# EAGLE design edition4-mainpart-3 (EAGLE 9.6.2)
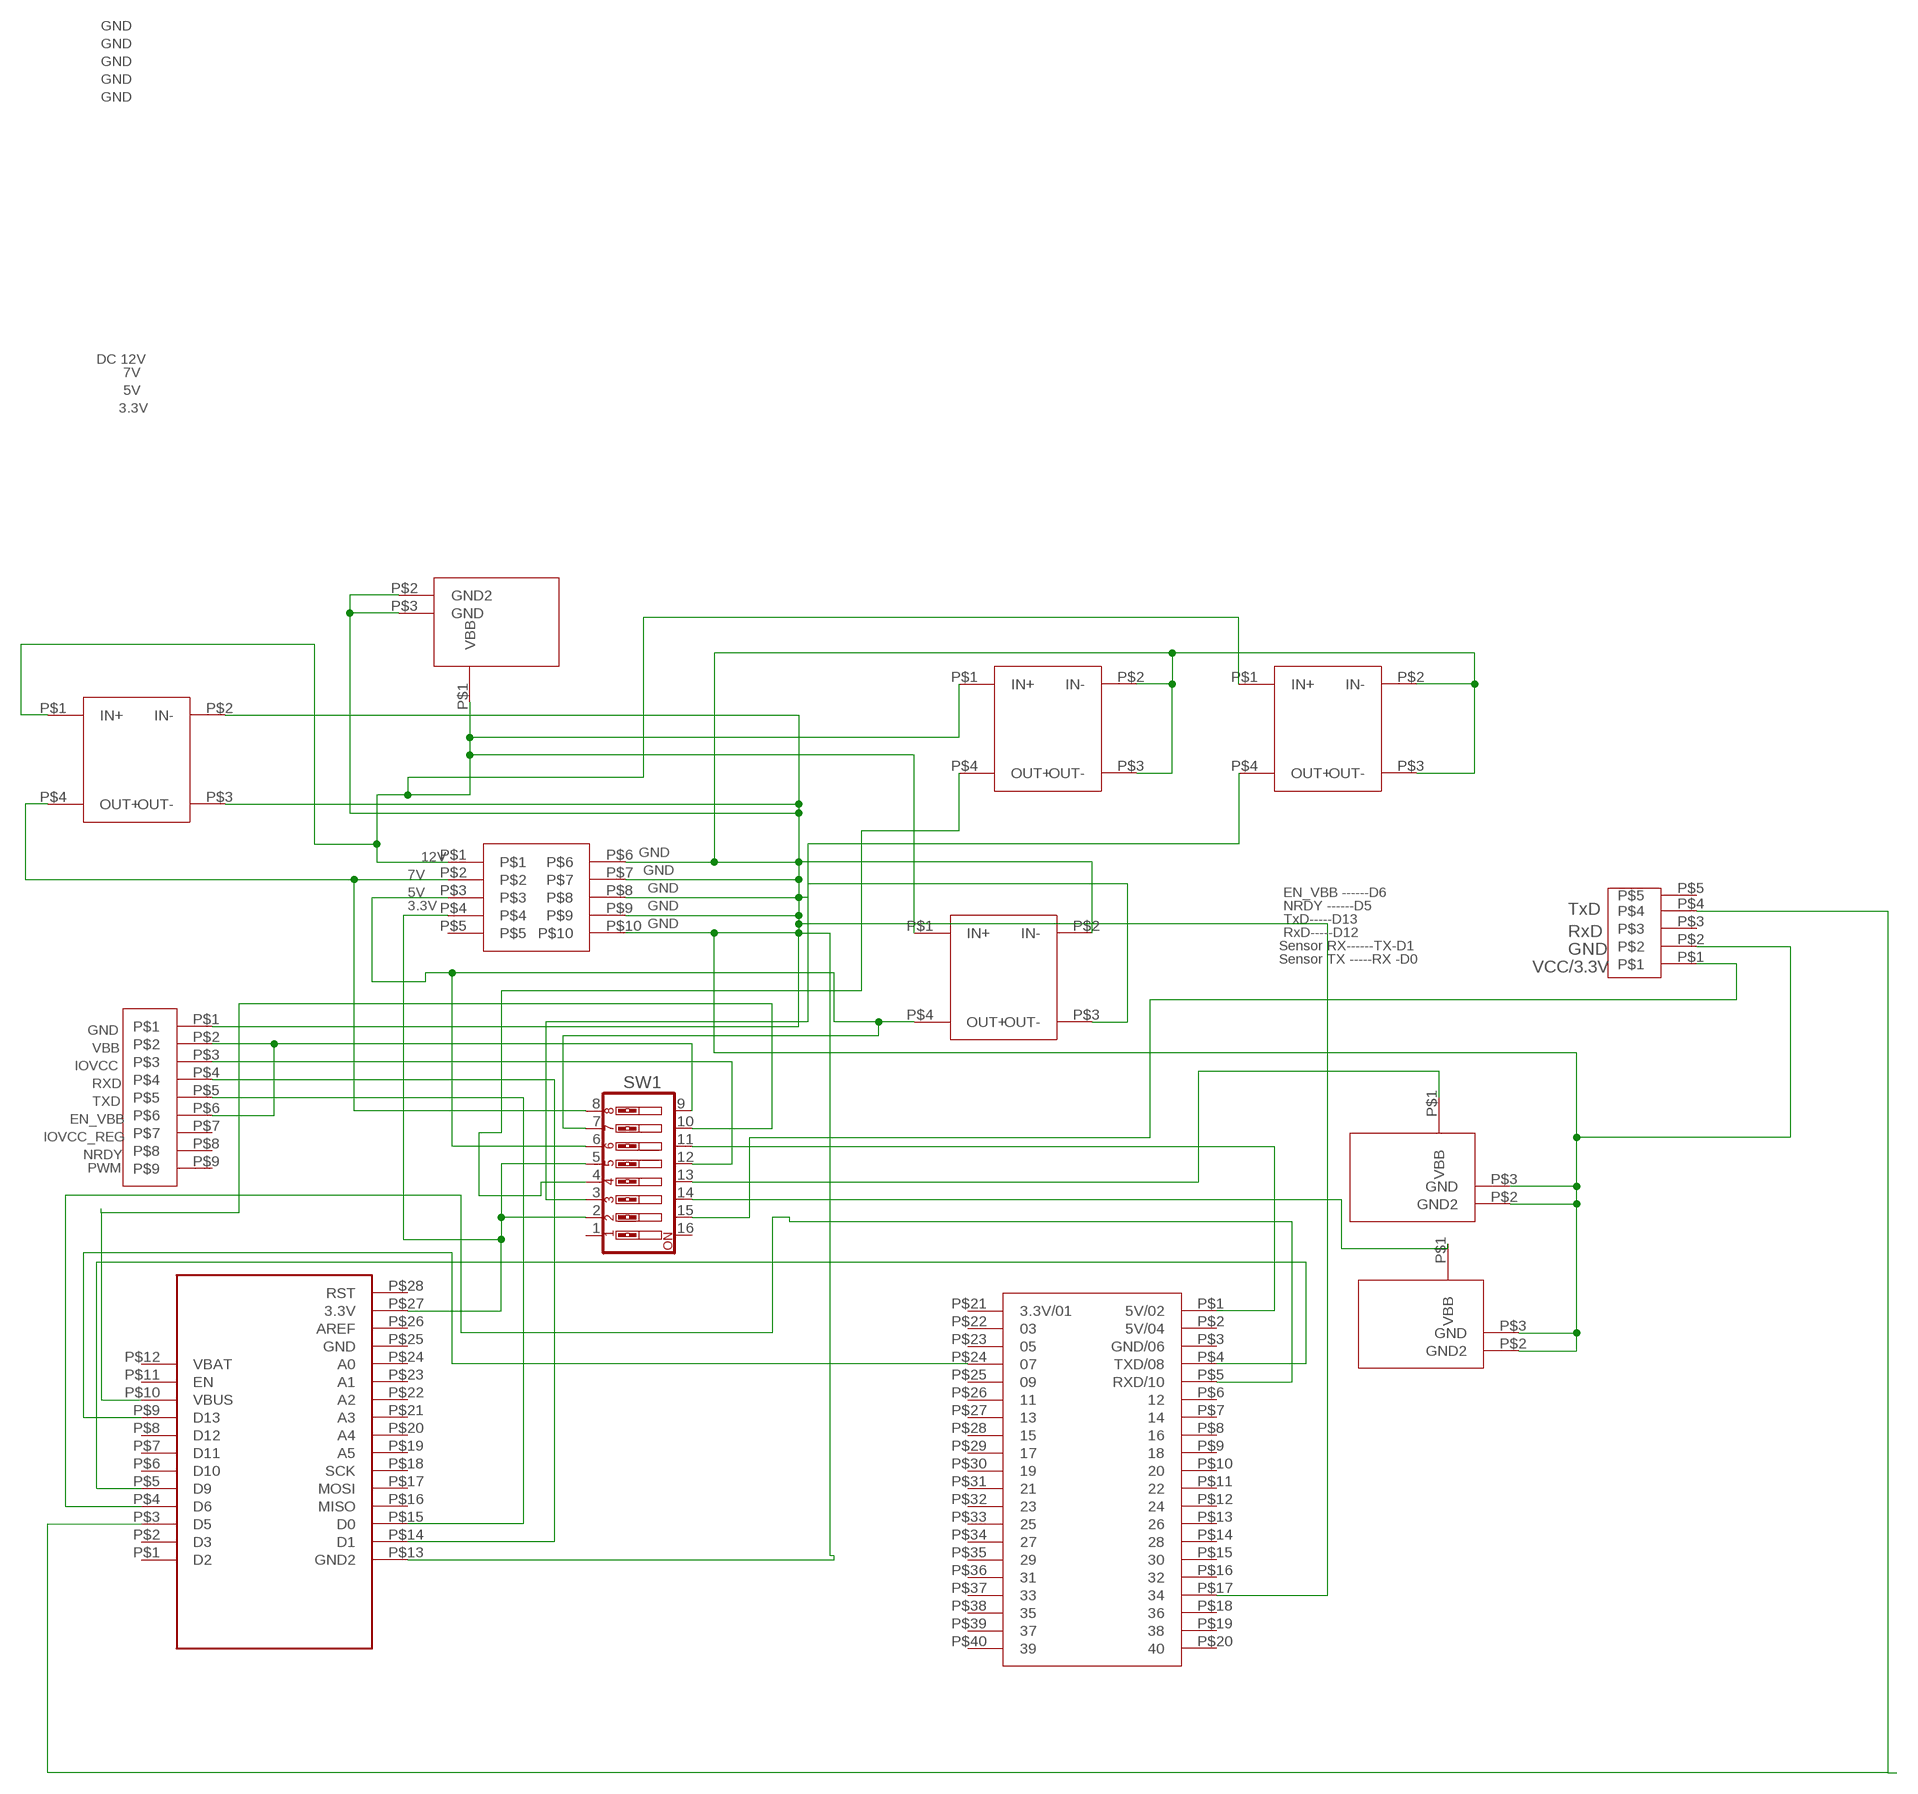
[diagram p0: schematic, sheet 1]

## Parts
SW1  SW_DIP-8  [EDG-08]
U$1  MH-MINI-360  [MH-MINI-360]
U$2  MH-MINI-360  [MH-MINI-360]
U$3  POWER  [POWERIN]
U$4  POWER  [POWERIN]
U$5  POWER  [POWERIN]
U$6  MH-MINI-360  [MH-MINI-360]
U$7  MH-MINI-360  [MH-MINI-360]
U$8  PIN  [PIN]
U$10  FEATHER  [FEATHER]
U$11  RASPBERRYPI  [RASPBERRYPI]
U$14  2X5FEET  [2X5FEET]
U$15  9FEETPIN  [9FEETPIN]

## Nets
GND: U$1.P$2(IN-) U$1.P$3(OUT-) U$2.P$2(IN-) U$2.P$3(OUT-) U$3.P$2(GND2) U$3.P$3(GND) U$4.P$2(GND2) U$4.P$3(GND) U$5.P$2(GND2) U$5.P$3(GND) U$6.P$2(IN-) U$6.P$3(OUT-) U$7.P$2(IN-) U$7.P$3(OUT-) U$8.P$2 U$10.P$13(GND2) U$11.P$17 U$14.P$6 U$14.P$7 U$14.P$8 U$14.P$9 U$14.P$10 U$15.P$1
N$1: SW1.10 U$10.P$10(VBUS)
N$2: SW1.3 U$7.P$4(OUT+)
N$3: SW1.2 SW1.5 U$10.P$27(3.3V) U$14.P$4
N$4: SW1.8 U$6.P$4(OUT+) U$14.P$2
N$5: SW1.9 U$15.P$2 U$15.P$6
N$6: U$8.P$4 U$10.P$3(D5)
N$7: SW1.12 U$15.P$3
N$8: U$10.P$14(D1) U$15.P$4
N$9: U$10.P$15(D0) U$15.P$5
N$10: U$10.P$9(D13) U$11.P$24
N$11: SW1.6 SW1.7 U$2.P$4(OUT+) U$14.P$3
N$12: SW1.11 U$11.P$1(5V/02)
N$13: SW1.15 U$8.P$1
N$14: SW1.13 U$5.P$1(VBB)
N$15: U$10.P$5(D9) U$11.P$4(TXD/08)
N$16: U$10.P$4(D6) U$11.P$5(RXD/10)
N$17: SW1.4 U$1.P$4(OUT+)
N$18: U$1.P$1(IN+) U$2.P$1(IN+) U$3.P$1(VBB) U$6.P$1(IN+) U$7.P$1(IN+) U$14.P$1
N$19: SW1.14 U$4.P$1(VBB)
Unconnected: SW1.1 SW1.16 U$8.P$3 U$8.P$5 U$10.P$1(D2) U$10.P$2(D3) U$10.P$6(D10) U$10.P$7(D11) U$10.P$8(D12) U$10.P$11(EN) U$10.P$12(VBAT) U$10.P$16(MISO) U$10.P$17(MOSI) U$10.P$18(SCK) U$10.P$19(A5) U$10.P$20(A4) U$10.P$21(A3) U$10.P$22(A2) U$10.P$23(A1) U$10.P$24(A0) U$10.P$25(GND) U$10.P$26(AREF) U$10.P$28(RST) U$11.P$2(5V/04) U$11.P$3(GND/06) U$11.P$6 U$11.P$7 U$11.P$8 U$11.P$9 U$11.P$10 U$11.P$11 U$11.P$12 U$11.P$13 U$11.P$14 U$11.P$15 U$11.P$16 U$11.P$18 U$11.P$19 U$11.P$20 U$11.P$21(3.3V/01) U$11.P$22 U$11.P$23 U$11.P$25 U$11.P$26 U$11.P$27 U$11.P$28 U$11.P$29 U$11.P$30 U$11.P$31 U$11.P$32 U$11.P$33 U$11.P$34 U$11.P$35 U$11.P$36 U$11.P$37 U$11.P$38 U$11.P$39 U$11.P$40 U$14.P$5 U$15.P$7 U$15.P$8 U$15.P$9

## Notes on the sheet
- GND
- GND
- GND
- GND
- GND
- DC 12V
- 7V
- 5V
- 3.3V
- GND
- 12V
- GND
- 7V
- GND
- 5V | EN_VBB ------D6
- 3.3V | GND | NRDY ------D5
- TxD
- TxD-----D13
- GND
- RxD-----D12 | RxD
- Sensor RX------TX-D1
- GND
- Sensor TX -----RX -D0
- VCC/3.3V
- GND
- VBB
- IOVCC
- RXD
- TXD
- EN_VBB
- IOVCC_REG
- NRDY
- PWM

## Library data of the parts
SW1 = special:SW_DIP-8: DIP SWITCH
U$1 U$2 U$6 U$7 = untitled:MH-MINI-360
U$3-U$5 = untitled:POWER
U$8 = untitled:PIN
U$10 = untitled:FEATHER
U$11 = untitled:RASPBERRYPI
U$14 = untitled:2X5FEET
U$15 = untitled:9FEETPIN

## Board
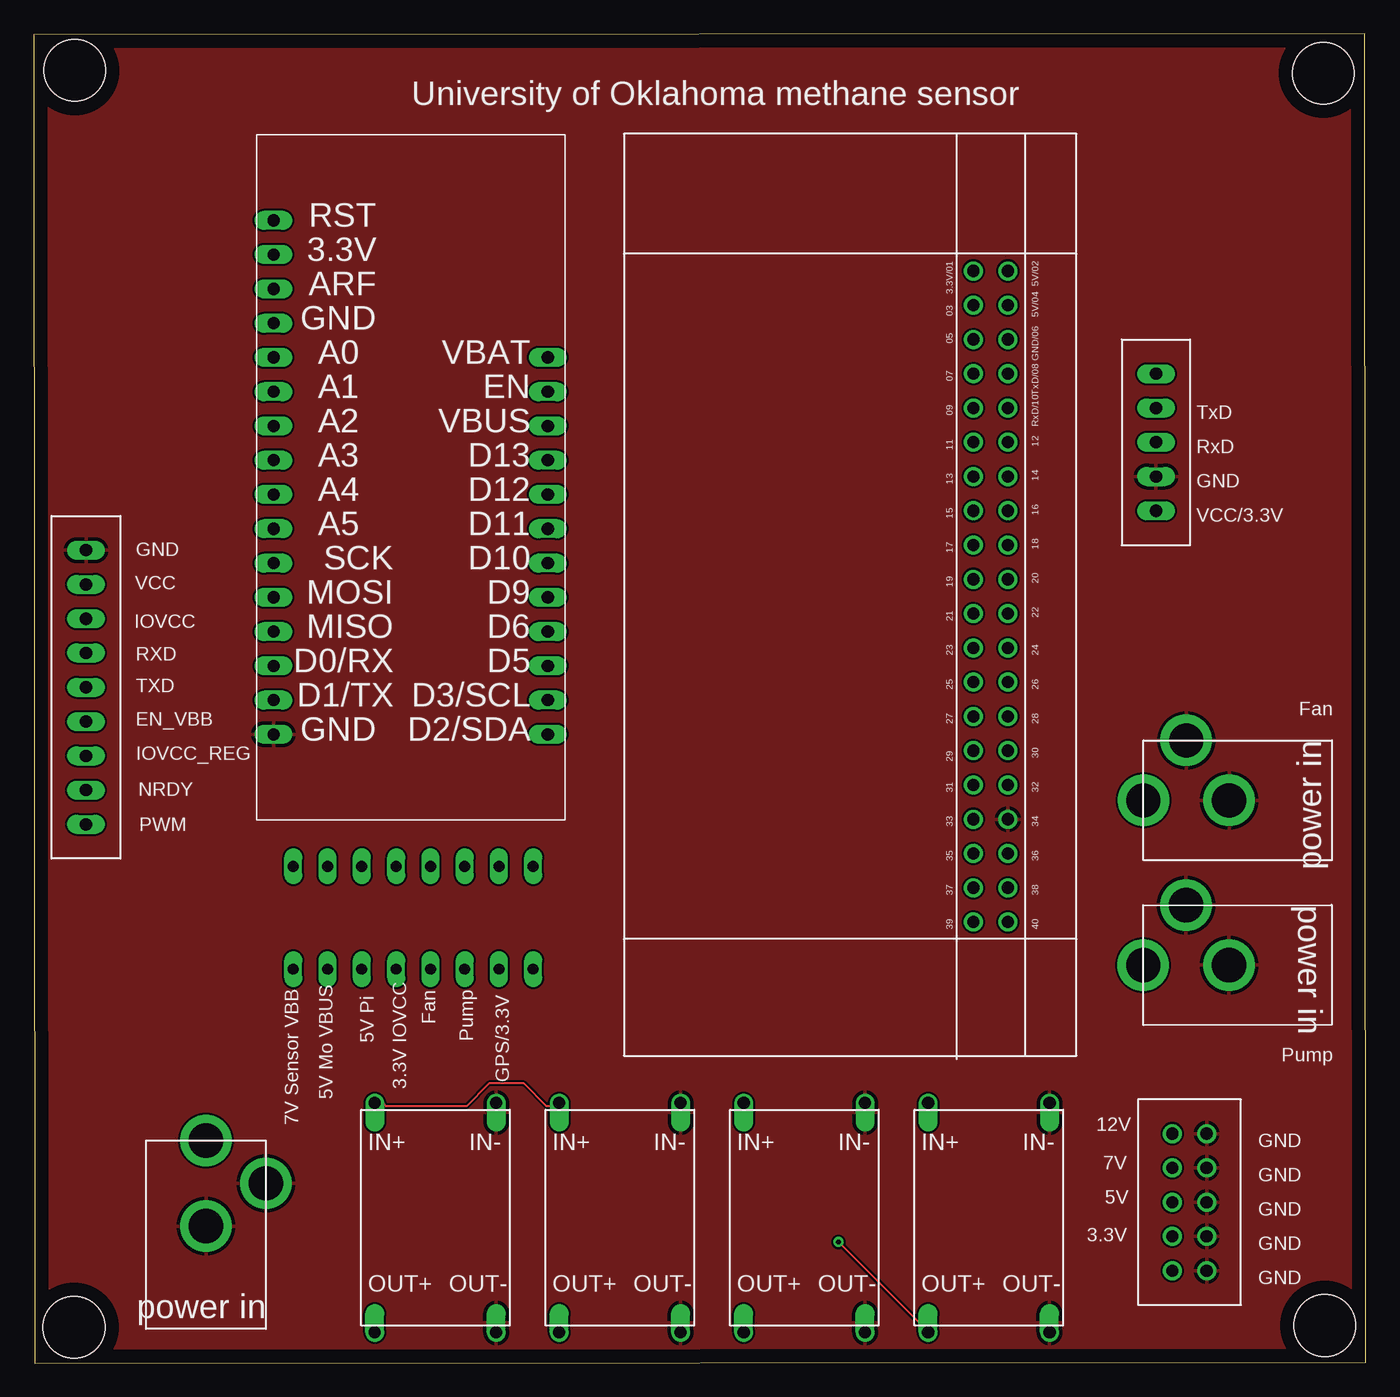
[diagram p1: board, top side]
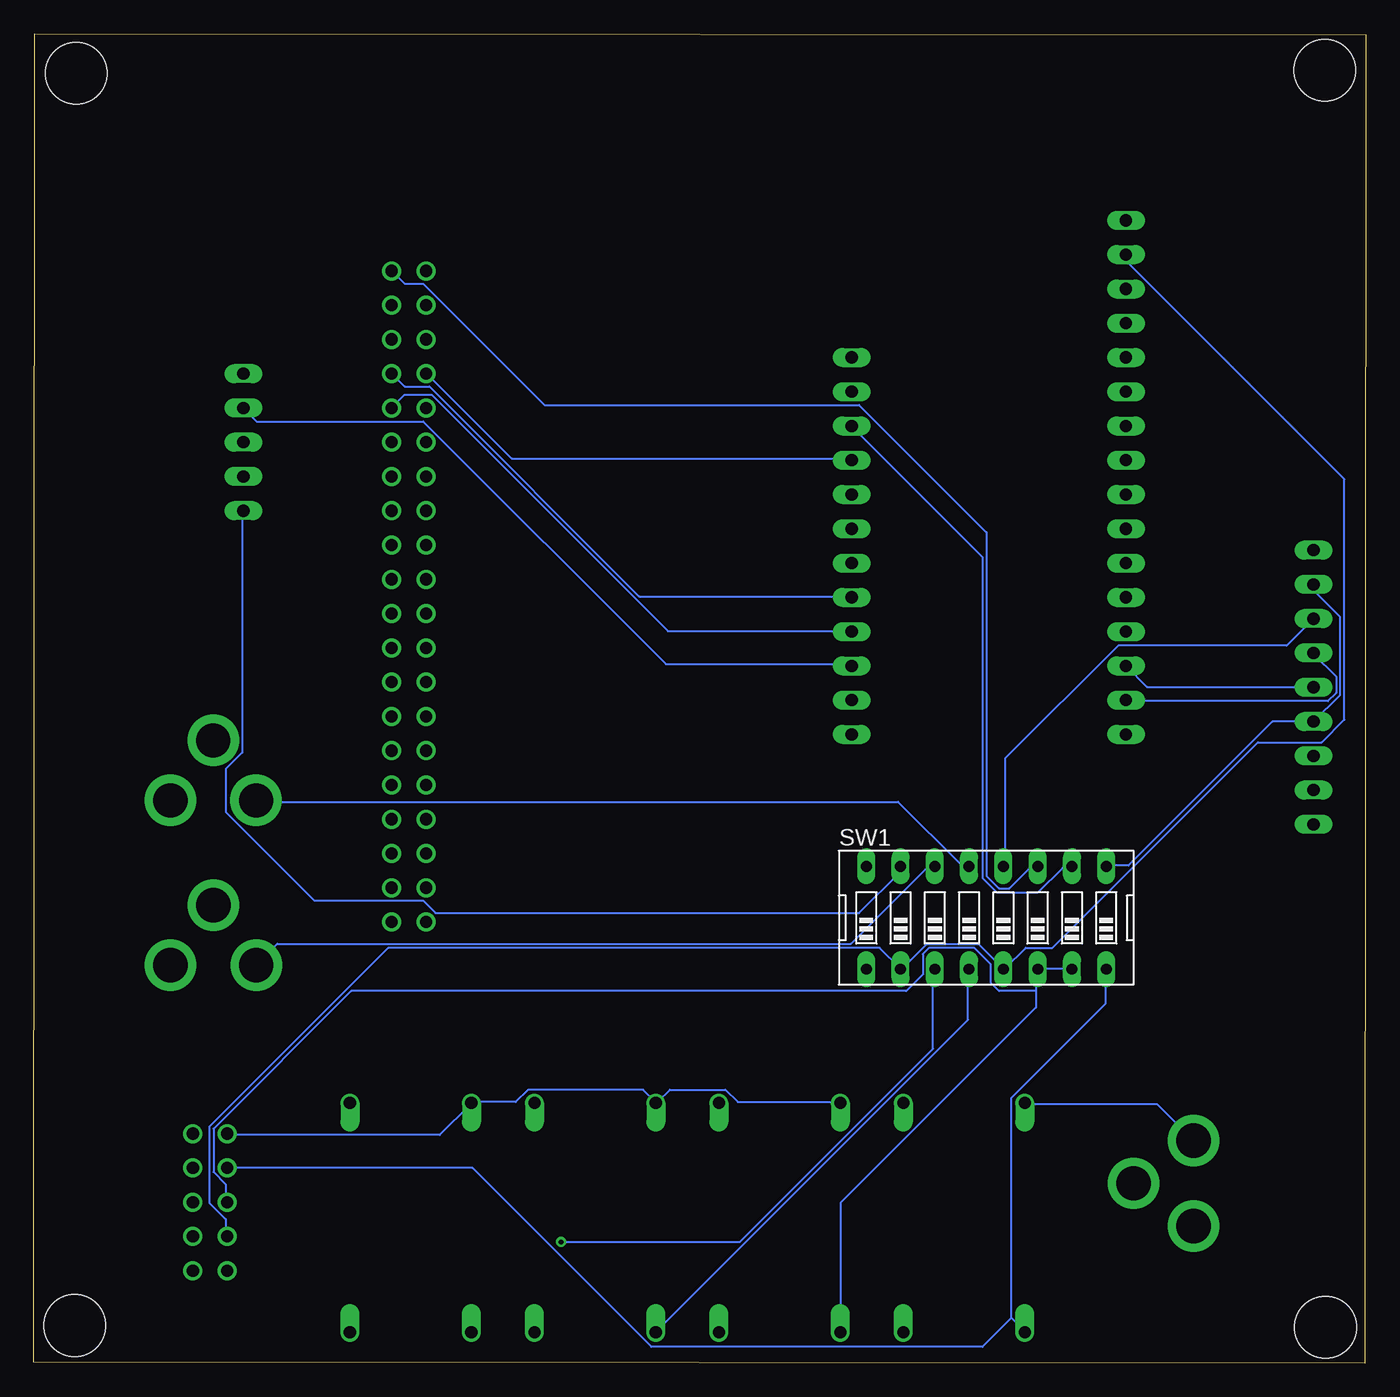
[diagram p2: board, bottom side, seen from below]

Size 98.73 x 98.54 mm. Coordinates in mm from the lower left corner, seen from the top.
Outline: 0.06,0 98.73,0.06 98.67,98.54 0,98.48 0.06,0
Copper layers (1*16): Top 0.035mm / dielectric 1.5mm / Bottom 0.035mm
Design rules "default": minimum track width 6mil, minimum drill 0.35mm, track to track 6mil, track to pad 6mil, pad to pad 6mil, via to via 6mil, smd to smd 6mil, copper to edge 40mil, drill to drill 6mil, minimum pad ring 10mil, minimum via ring 8mil, stop-mask expansion 4mil, vias tented up to drill 0mil, thermal gap 10mil
Holes 4.57 mm at 2.98,2.67 3.05,95.82 95.57,95.63 95.69,2.79

### Footprints (pad centres in the part's own frame; a part is rotated, then mirrored left to right if it is on the bottom)
EDG-08 = drill 0.813 long: 1 -8.89,-3.81; 2 -6.35,-3.81; 3 -3.81,-3.81; 4 -1.27,-3.81; 5 1.27,-3.81; 6 3.81,-3.81; 7 6.35,-3.81; 8 8.89,-3.81; 9 8.89,3.81; 10 6.35,3.81; 11 3.81,3.81; 12 1.27,3.81; 13 -1.27,3.81; 14 -3.81,3.81; 15 -6.35,3.81; 16 -8.89,3.81
MH-MINI-360 = drill 0.9 offset: P$1 0,1; P$2 9,1; P$3 9,-16; P$4 0,-16
POWERIN = drill 2.54 pad 3.81: P$1 4.445,-13.97; P$2 4.445,-7.62; P$3 0,-10.795
PIN = drill 0.9 pad 1.143 long: P$1 0,-7.62; P$2 0,-5.08; P$3 0,-2.54; P$4 0,0; P$5 0,2.54
FEATHER = drill 0.9 pad 1.143 long: P$1 0,-5.08; P$2 0,-7.62; P$3 0,-10.16; P$4 0,-12.7; P$5 0,-15.24; P$6 0,-17.78; P$7 0,-20.32; P$8 0,-22.86; P$9 0,-25.4; P$10 0,-27.94; P$11 0,-30.48; P$12 0,-33.02; P$13 20.32,-5.08; P$14 20.32,-7.62; P$15 20.32,-10.16; P$16 20.32,-12.7; P$17 20.32,-15.24; P$18 20.32,-17.78; P$19 20.32,-20.32; P$20 20.32,-22.86; P$21 20.32,-25.4; P$22 20.32,-27.94; P$23 20.32,-30.48; P$24 20.32,-33.02; P$25 20.32,-35.56; P$26 20.32,-38.1; P$27 20.32,-40.64; P$28 20.32,-43.18
RASPBERRYPI = drill 0.9 pad 1.143: P$1 10.16,-5.08; P$2 12.7,-5.08; P$3 15.24,-5.08; P$4 17.78,-5.08; P$5 20.32,-5.08; P$6 22.86,-5.08; P$7 25.4,-5.08; P$8 27.94,-5.08; P$9 30.48,-5.08; P$10 33.02,-5.08; P$11 35.56,-5.08; P$12 38.1,-5.08; P$13 40.64,-5.08; P$14 43.18,-5.08; P$15 45.72,-5.08; P$16 48.26,-5.08; P$17 50.8,-5.08; P$18 53.34,-5.08; P$19 55.88,-5.08; P$20 58.42,-5.08; P$21 10.16,-7.62; P$22 12.7,-7.62; P$23 15.24,-7.62; P$24 17.78,-7.62; P$25 20.32,-7.62; P$26 22.86,-7.62; P$27 25.4,-7.62; P$28 27.94,-7.62; P$29 30.48,-7.62; P$30 33.02,-7.62; P$31 35.56,-7.62; P$32 38.1,-7.62; P$33 40.64,-7.62; P$34 43.18,-7.62; P$35 45.72,-7.62; P$36 48.26,-7.62; P$37 50.8,-7.62; P$38 53.34,-7.62; P$39 55.88,-7.62; P$40 58.42,-7.62
2X5FEET = drill 0.9: P$1 0,-2.54; P$2 0,-5.08; P$3 0,-7.62; P$4 0,-10.16; P$5 0,-12.7; P$6 2.54,-2.54; P$7 2.54,-5.08; P$8 2.54,-7.62; P$9 2.54,-10.16; P$10 2.54,-12.7
9FEETPIN = drill 0.9 long: P$1 0,2.54; P$2 0,0; P$3 0,-2.54; P$4 0,-5.08; P$5 0,-7.62; P$6 0,-10.16; P$7 0,-12.7; P$8 0,-15.24; P$9 0,-17.78

### Placement (x,y rotation side)
SW1  28.13,33.02 0 bottom
U$1  52.62,18.29 0 top
U$2  38.95,18.29 0 top
U$3  17.21,2.54 180 top
U$4  96.2,33.97 270.1 top
U$5  96.22,46.16 270 top
U$6  25.27,18.29 0 top
U$7  66.29,18.29 0 top
U$8  83.19,70.8 0 top
U$10  38.1,41.53 180 top
U$11  77.28,91.12 270 top
U$14  84.39,19.56 0 top
U$15  3.87,57.72 0 top

### Tracks (layer width: path | path; a pad name or v marks a point on that pad's centre or on a via)
GND
  pour Top: 0.06,98.55 99,98.55 99,87.63 99,-0.38 64.2,-0.38 -0.44,-0.38 -0.44,0.25 -0.44,98.55
N$1
  Bottom 0.152: SW1.10 21.86,36.73 22.47,36.73 24.3,34.9 27.34,34.9 28.41,35.97 28.41,59.74 38.01,69.34 U$10.P$10
N$2  (via drill 0.35)
  Top 0.152: v59.65,8.99 66.21,2.44 U$7.P$4
  Bottom 0.152: v59.65,8.99 46.39,8.99 32.07,23.32 32.07,29.11 SW1.3
N$3
  Bottom 0.152: U$14.P$4 84.49,9.45 84.49,10.67 85.71,11.89 85.71,17.53 72.45,30.79 36.03,30.79 34.51,29.26 SW1.2 34.35,29.26 32.52,31.09 28.71,31.09 26.89,29.26 SW1.5 26.73,29.26 25.21,30.79 23.23,30.79 7.99,46.02 3.26,46.02 1.59,47.7 1.59,65.53 17.74,81.69 17.74,82.14 U$10.P$27
N$4
  Bottom 0.152: 26.28,3.35 26.28,19.66 19.27,26.67 19.27,29.11 SW1.8 | 26.28,3.35 25.36,2.44 U$6.P$4 | U$14.P$2 66.21,14.48 52.95,1.22 28.41,1.22 26.28,3.35
N$5
  Bottom 0.152: 3.87,47.55 6.92,47.55 17.59,36.88 19.11,36.88 SW1.9 | U$15.P$2 3.87,57.3 1.89,55.32 1.89,49.53 3.87,47.55 | 3.87,47.55 U$15.P$6
N$6
  Bottom 0.152: U$10.P$3 38.16,51.82 51.88,51.82 69.86,69.8 82.21,69.8 83.12,70.71 U$8.P$4
N$7
  Bottom 0.152: SW1.12 26.73,36.88 26.73,44.81 18.35,53.19 5.85,53.19 3.87,55.17 U$15.P$3
N$8
  Bottom 0.152: U$10.P$14 17.74,49.07 2.81,49.07 2.2,49.68 2.2,50.9 3.87,52.58 U$15.P$4
N$9
  Bottom 0.152: U$15.P$5 3.87,50.14 16.22,50.14 17.74,51.66 U$10.P$15
N$10
  Bottom 0.152: U$10.P$9 38.16,67.06 63.31,67.06 69.56,73.3 U$11.P$24
N$11
  Bottom 0.152: SW1.7 21.86,29.26 24.3,29.26 SW1.6 24.45,29.11 24.45,27.58 | 24.45,27.58 24.45,26.36 38.93,11.89 38.93,2.44 U$2.P$4 | 24.45,27.58 27.19,27.58 27.8,28.19 27.8,29.57 29.02,30.79 32.37,30.79 32.83,30.33 32.83,28.8 34.05,27.58 75.2,27.58 85.41,17.37 85.41,14.17 84.49,13.26 84.49,12.04 U$14.P$3
N$12
  Bottom 0.152: SW1.11 24.45,36.73 24.9,36.73 26.43,35.2 27.19,35.2 28.11,36.12 28.11,61.57 37.55,71.02 60.87,71.02 69.86,80.01 71.23,80.01 72.15,80.92 U$11.P$1
N$13
  Bottom 0.152: SW1.15 34.51,36.73 34.51,36.42 37.55,33.38 68.95,33.38 69.86,34.29 77.94,34.29 84.49,40.84 84.49,44.04 83.27,45.26 83.27,63.09 U$8.P$1
N$14
  Bottom 0.152: SW1.13 29.48,36.88 29.93,36.88 34.66,41.6 82.21,41.6 U$5.P$1
N$15
  Bottom 0.152: U$10.P$5 38.16,56.84 53.86,56.84 69.41,72.39 71.23,72.39 72.15,73.3 U$11.P$4
N$16
  Bottom 0.152: U$10.P$4 38.16,54.25 51.73,54.25 69.25,71.78 71.23,71.78 72.15,70.87 U$11.P$5
N$17
  Bottom 0.152: SW1.4 29.48,29.11 29.48,25.45 52.49,2.44 U$1.P$4
N$18
  Top 0.152: U$6.P$1 25.36,19.2 25.97,19.2 26.12,19.05 32.07,19.05 33.74,20.73 36.33,20.73 38.01,19.05 38.77,19.05 38.93,19.2 U$2.P$1
  Bottom 0.152: U$3.P$1 15.46,19.2 25.21,19.2 U$6.P$1 | U$2.P$1 39.08,19.36 46.55,19.36 47.46,20.27 51.57,20.27 52.49,19.36 U$1.P$1 52.64,19.36 53.56,20.27 62.09,20.27 63,19.36 66.21,19.36 U$7.P$1 66.36,19.2 68.64,16.92 84.34,16.92 U$14.P$1
N$19
  Bottom 0.152: SW1.14 32.07,36.73 32.52,36.73 38.16,31.09 80.68,31.09 82.21,29.57 U$4.P$1

### Text on the board
tNames: University of Oklahoma methane sensor | TxD | RxD | GND | VCC/3.3V | GND | VCC | IOVCC | RXD | TXD | Fan | EN_VBB | IOVCC_REG | NRDY | PWM | Fan | 5V Pi | Pump | Pump | GPS/3.3V | 5V Mo VBUS | 3.3V IOVCC | 7V Sensor VBB | 12V | GND | 7V | GND | 5V | GND | 3.3V | GND | GND